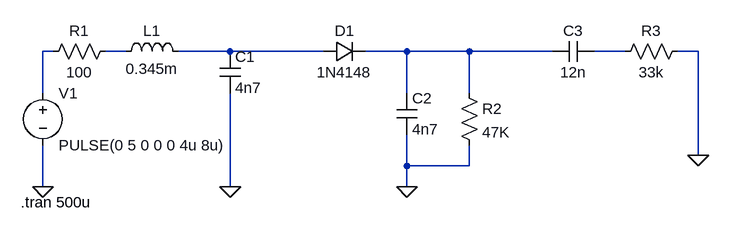
[diagram p0: schematic Circuit.asc]
Circuit.asc, the LTspice schematic file:
Version 4
SHEET 1 1092 680
WIRE 80 48 64 48
WIRE 192 48 160 48
WIRE 352 48 272 48
WIRE 496 48 352 48
WIRE 624 48 560 48
WIRE 720 48 624 48
WIRE 848 48 720 48
WIRE 960 48 912 48
WIRE 1072 48 1040 48
WIRE 64 112 64 48
WIRE 624 112 624 48
WIRE 720 112 720 48
WIRE 1072 208 1072 48
WIRE 624 224 624 176
WIRE 720 224 720 192
WIRE 720 224 624 224
WIRE 64 256 64 192
WIRE 352 256 352 112
WIRE 624 256 624 224
FLAG 64 256 0
FLAG 352 256 0
FLAG 624 256 0
FLAG 1072 208 0
SYMBOL voltage 64 96 R0
WINDOW 123 0 0 Left 2
WINDOW 39 0 0 Left 2
SYMATTR InstName V1
SYMATTR Value PULSE(0 5 0 0 0 4u 8u)
SYMBOL ind 176 64 R270
WINDOW 0 32 56 VTop 2
WINDOW 3 5 56 VBottom 2
SYMATTR InstName L1
SYMATTR Value 0.345m
SYMBOL cap 336 48 R0
SYMATTR InstName C1
SYMATTR Value 4n7
SYMBOL res 176 32 R90
WINDOW 0 0 56 VBottom 2
WINDOW 3 32 56 VTop 2
SYMATTR InstName R1
SYMATTR Value 100
SYMBOL diode 496 64 R270
WINDOW 0 32 32 VTop 2
WINDOW 3 0 32 VBottom 2
SYMATTR InstName D1
SYMATTR Value 1N4148
SYMBOL cap 608 112 R0
SYMATTR InstName C2
SYMATTR Value 4n7
SYMBOL res 704 96 R0
SYMATTR InstName R2
SYMATTR Value 47K
SYMBOL cap 912 32 R90
WINDOW 0 0 32 VBottom 2
WINDOW 3 32 32 VTop 2
SYMATTR InstName C3
SYMATTR Value 12n
SYMBOL res 1056 32 R90
WINDOW 0 0 56 VBottom 2
WINDOW 3 32 56 VTop 2
SYMATTR InstName R3
SYMATTR Value 33k
TEXT 30 280 Left 2 !.tran 500u

The netlist it stands for:
* Circuit.asc
V1 N001 0 PULSE(0 5 0 0 0 4u 8u)
L1 N002 N003 0.345m
C1 N003 0 4n7
R1 N002 N001 100
D1 N003 N004 1N4148
C2 N004 0 4n7
R2 N004 0 47K
C3 N005 N004 12n
R3 0 N005 33k
.model D D
.lib standard.dio
.tran 500u
.backanno
.end